# Altium schematic sheet Top.SchDoc
size C; Author: E. Sims; Organization: Let's Build Rockets Inc.; SheetNumber: 1; SheetTotal: 5
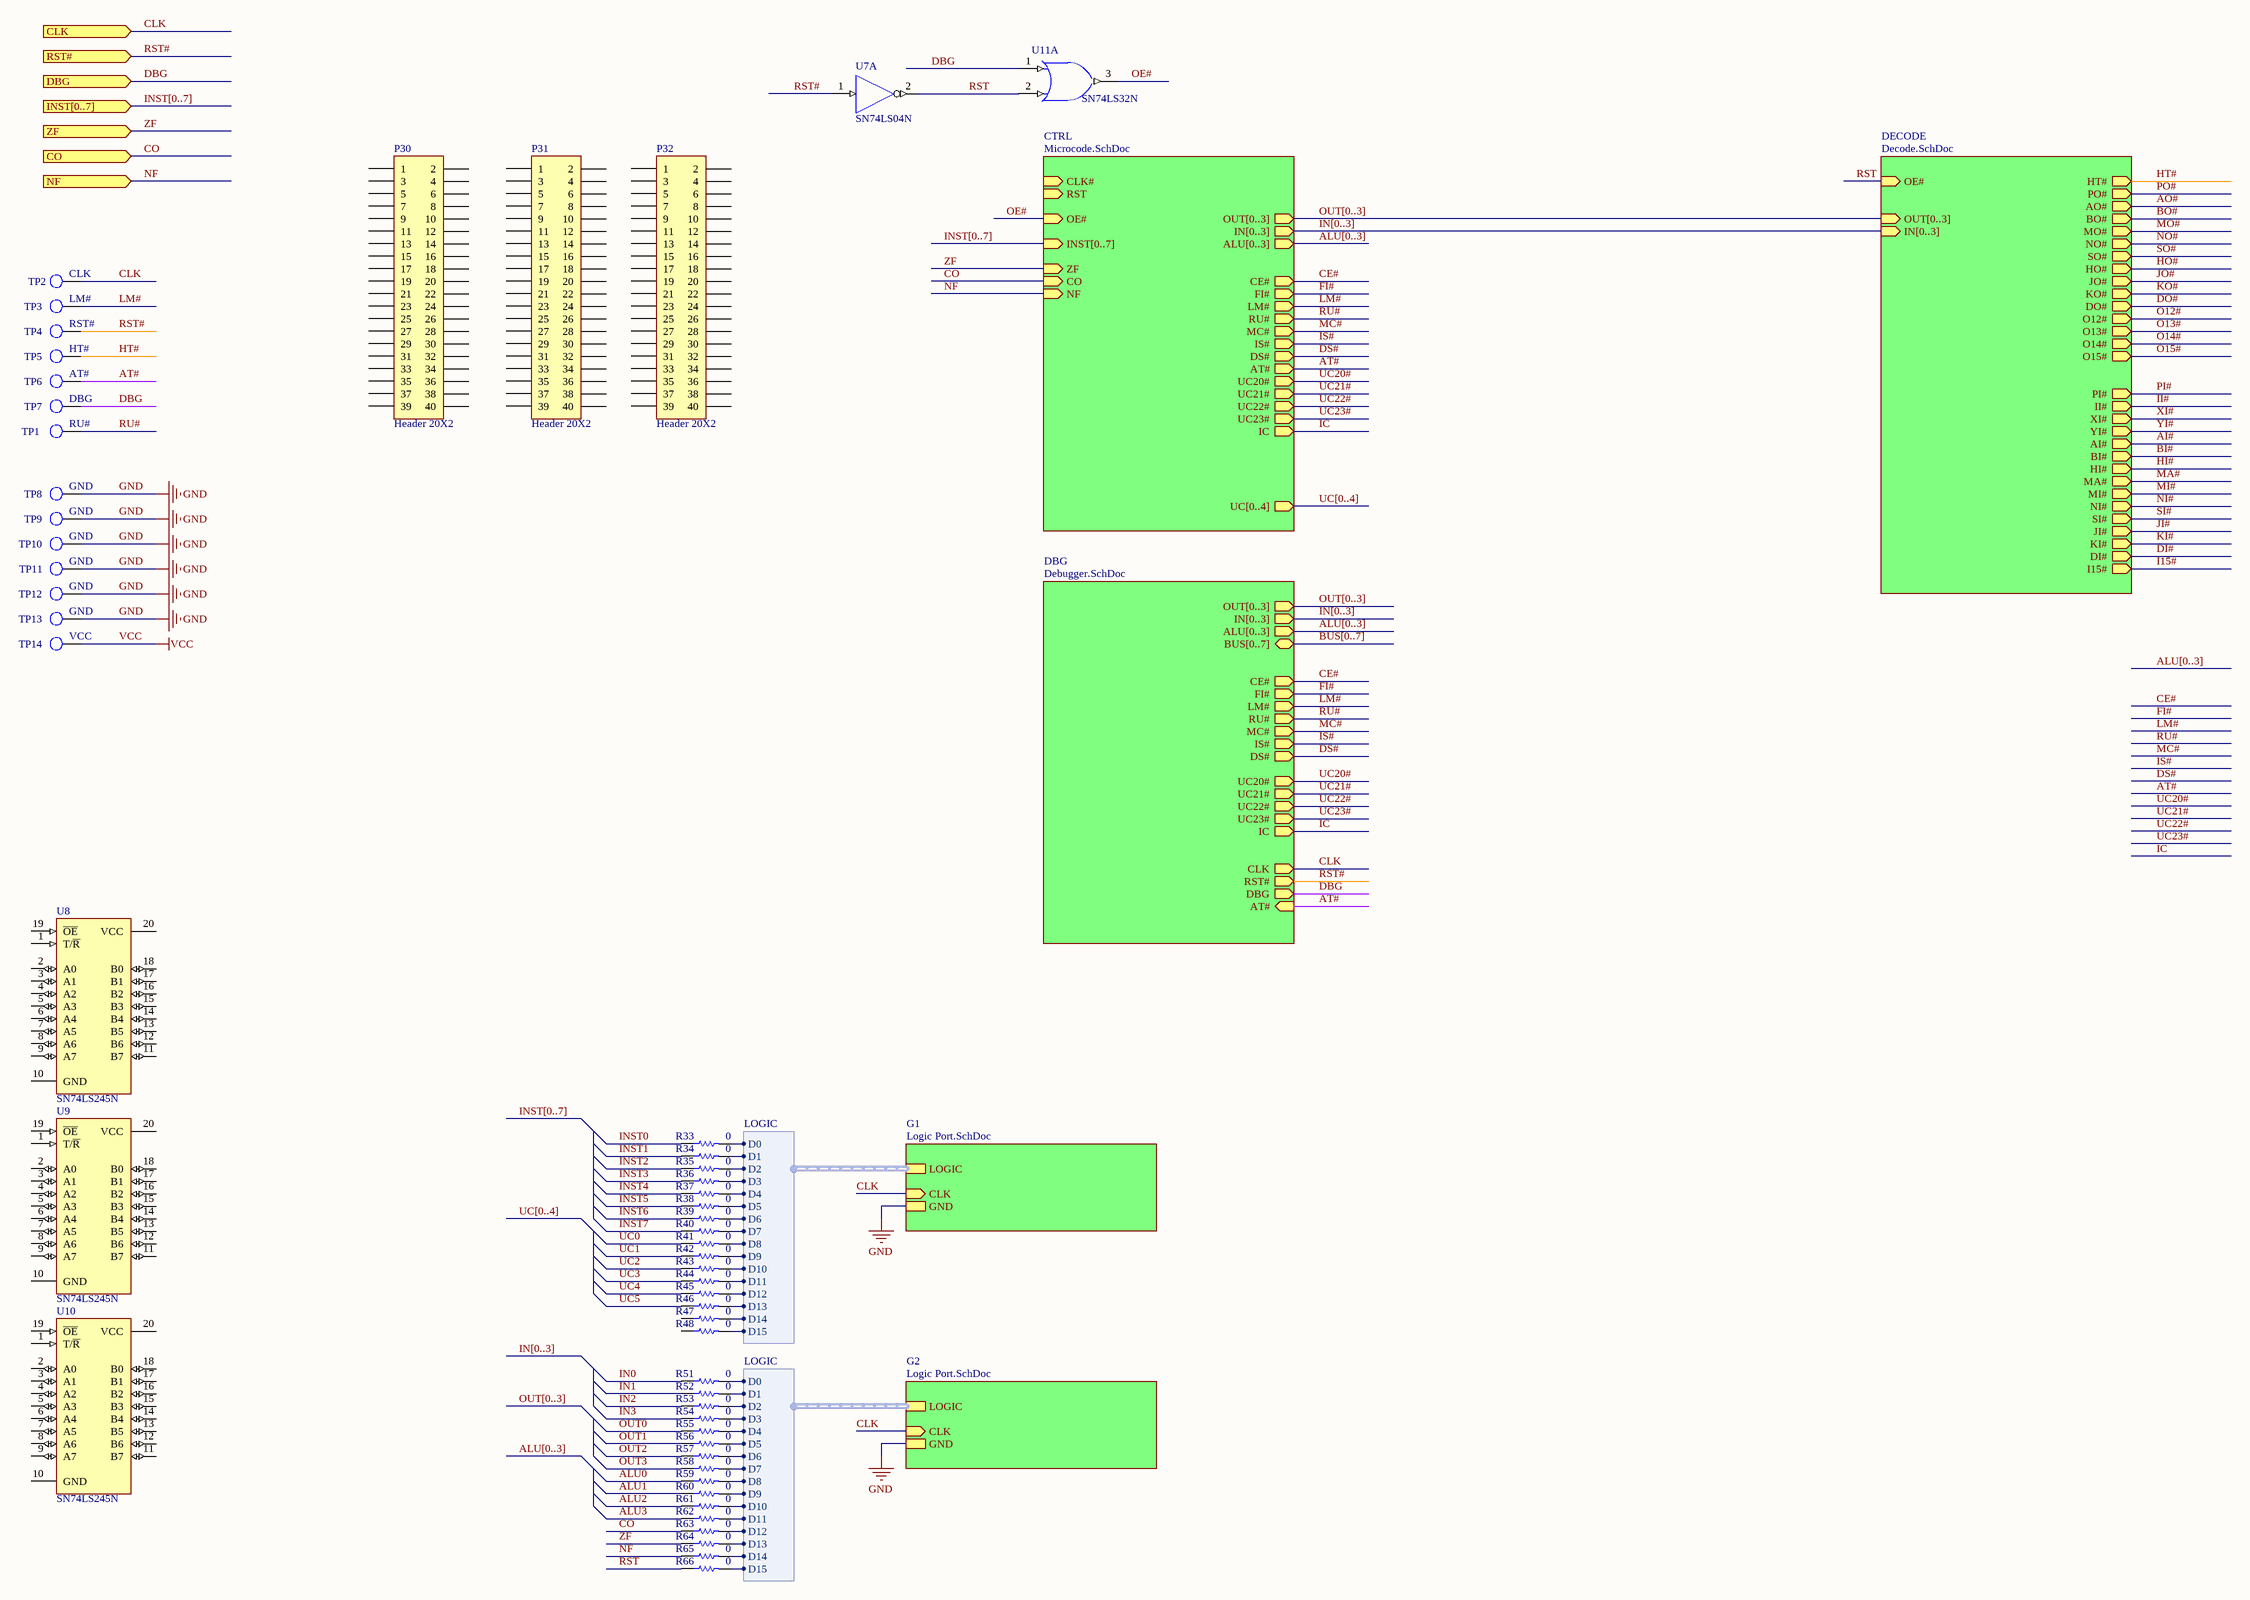
[diagram p0: Top.SchDoc]

## Parts
P30  Header 20X2  [HDR2X20]
P31  Header 20X2  [HDR2X20]
P32  Header 20X2  [HDR2X20]
R33  value 0  [AXIAL-0.3]  (hidden comment: Res1)
R34  value 0  [AXIAL-0.3]  (hidden comment: Res1)
R35  value 0  [AXIAL-0.3]  (hidden comment: Res1)
R36  value 0  [AXIAL-0.3]  (hidden comment: Res1)
R37  value 0  [AXIAL-0.3]  (hidden comment: Res1)
R38  value 0  [AXIAL-0.3]  (hidden comment: Res1)
R39  value 0  [AXIAL-0.3]  (hidden comment: Res1)
R40  value 0  [AXIAL-0.3]  (hidden comment: Res1)
R41  value 0  [AXIAL-0.3]  (hidden comment: Res1)
R42  value 0  [AXIAL-0.3]  (hidden comment: Res1)
R43  value 0  [AXIAL-0.3]  (hidden comment: Res1)
R44  value 0  [AXIAL-0.3]  (hidden comment: Res1)
R45  value 0  [AXIAL-0.3]  (hidden comment: Res1)
R46  value 0  [AXIAL-0.3]  (hidden comment: Res1)
R47  value 0  [AXIAL-0.3]  (hidden comment: Res1)
R48  value 0  [AXIAL-0.3]  (hidden comment: Res1)
R51  value 0  [AXIAL-0.3]  (hidden comment: Res1)
R52  value 0  [AXIAL-0.3]  (hidden comment: Res1)
R53  value 0  [AXIAL-0.3]  (hidden comment: Res1)
R54  value 0  [AXIAL-0.3]  (hidden comment: Res1)
R55  value 0  [AXIAL-0.3]  (hidden comment: Res1)
R56  value 0  [AXIAL-0.3]  (hidden comment: Res1)
R57  value 0  [AXIAL-0.3]  (hidden comment: Res1)
R58  value 0  [AXIAL-0.3]  (hidden comment: Res1)
R59  value 0  [AXIAL-0.3]  (hidden comment: Res1)
R60  value 0  [AXIAL-0.3]  (hidden comment: Res1)
R61  value 0  [AXIAL-0.3]  (hidden comment: Res1)
R62  value 0  [AXIAL-0.3]  (hidden comment: Res1)
R63  value 0  [AXIAL-0.3]  (hidden comment: Res1)
R64  value 0  [AXIAL-0.3]  (hidden comment: Res1)
R65  value 0  [AXIAL-0.3]  (hidden comment: Res1)
R66  value 0  [AXIAL-0.3]  (hidden comment: Res1)
TP1  RU#  [KSTN-5011_V]  (no BOM)
TP2  CLK  [KSTN-5011_V]  (no BOM)
TP3  LM#  [KSTN-5011_V]  (no BOM)
TP4  RST#  [KSTN-5011_V]  (no BOM)
TP5  HT#  [KSTN-5011_V]  (no BOM)
TP6  AT#  [KSTN-5011_V]  (no BOM)
TP7  DBG  [KSTN-5011_V]  (no BOM)
TP8  GND  [KSTN-5011_V]  (no BOM)
TP9  GND  [KSTN-5011_V]  (no BOM)
TP10  GND  [KSTN-5011_V]  (no BOM)
TP11  GND  [KSTN-5011_V]  (no BOM)
TP12  GND  [KSTN-5011_V]  (no BOM)
TP13  GND  [KSTN-5011_V]  (no BOM)
TP14  VCC  [KSTN-5011_V]  (no BOM)
U7  SN74LS04N  [N014]  (part A of 6)
U8  SN74LS245N  [N020]
U9  SN74LS245N  [N020]
U10  SN74LS245N  [N020]
U11  SN74LS32N  [N014]  (part A of 4)

## Sub-sheets
CTRL = Microcode.SchDoc: NF (in), RST (in), CLK# (in), ZF (in), INST[0..7] (in), CO (in), UC[0..4] (out), IN[0..3] (out), ALU[0..3] (out), OUT[0..3] (out), OE# (in), IS# (out), UC21# (out), RU# (out), AT# (out), MC# (out), CE# (out), IC (out), UC22# (out), DS# (out), FI# (out), UC23# (out), UC20# (out), LM# (out)
DBG = Debugger.SchDoc: IN[0..3] (out), ALU[0..3] (out), OUT[0..3] (out), IS# (out), UC21# (out), RU# (out), MC# (out), CE# (out), IC (out), UC22# (out), DS# (out), FI# (out), UC23# (out), UC20# (out), LM# (out), CLK (out), RST# (out), DBG (out), AT# (in), BUS[0..7] (bidir)
DECODE = Decode.SchDoc: IN[0..3] (in), OUT[0..3] (in), OE# (in), PO# (out), HT# (out), NO# (out), JO# (out), BO# (out), O14# (out), SO# (out), O15# (out), KO# (out), DO# (out), AO# (out), O12# (out), O13# (out), MO# (out), HO# (out), I15# (out), JI# (out), SI# (out), PI# (out), XI# (out), MI# (out), HI# (out), II# (out), DI# (out), NI# (out), BI# (out), MA# (out), YI# (out), KI# (out), AI# (out)
G1 = Logic Port.SchDoc: GND, CLK (in), LOGIC (harness LOGIC)
G2 = Logic Port.SchDoc: GND, CLK (in), LOGIC (harness LOGIC)

## Ports
CLK (in), CO (in), DBG (in), INST[0..7] (in), NF (in), RST# (in), ZF (in)

## Harnesses
LOGIC: D0, D1, D2, D3, D4, D5, D6, D7, D8, D9, D10, D11, D12, D13, D14, D15

## Nets
GND: TP8.1 TP9.1 TP10.1 TP11.1 TP12.1 TP13.1 U7.7(GND) U11.7(GND) ; sheet G1/GND, sheet G2/GND
VCC: TP14.1 U7.14(VCC) U11.14(VCC)
AI#: sheet DECODE/AI#
ALU0: R59.1
ALU1: R60.1
ALU2: R61.1
ALU3: R62.1
AO#: sheet DECODE/AO#
AT#: TP6.1 ; sheet CTRL/AT#, sheet DBG/AT#
BI#: sheet DECODE/BI#
BO#: sheet DECODE/BO#
CE#: sheet CTRL/CE#, sheet DBG/CE#
CLK: TP2.1 ; port CLK, sheet G1/CLK, sheet G2/CLK, sheet DBG/CLK
CO: R63.1 ; port CO, sheet CTRL/CO
DBG: TP7.1 U11.1(A) ; port DBG, sheet DBG/DBG
DI#: sheet DECODE/DI#
DO#: sheet DECODE/DO#
DS#: sheet CTRL/DS#, sheet DBG/DS#
FI#: sheet CTRL/FI#, sheet DBG/FI#
HI#: sheet DECODE/HI#
HO#: sheet DECODE/HO#
HT#: TP5.1 ; sheet DECODE/HT#
I15#: sheet DECODE/I15#
IC: sheet CTRL/IC, sheet DBG/IC
II#: sheet DECODE/II#
IN0: R51.1
IN1: R52.1
IN2: R53.1
IN3: R54.1
INST0: R33.1
INST1: R34.1
INST2: R35.1
INST3: R36.1
INST4: R37.1
INST5: R38.1
INST6: R39.1
INST7: R40.1
IS#: sheet CTRL/IS#, sheet DBG/IS#
JI#: sheet DECODE/JI#
JO#: sheet DECODE/JO#
KI#: sheet DECODE/KI#
KO#: sheet DECODE/KO#
LM#: TP3.1 ; sheet CTRL/LM#, sheet DBG/LM#
MA#: sheet DECODE/MA#
MC#: sheet CTRL/MC#, sheet DBG/MC#
MI#: sheet DECODE/MI#
MO#: sheet DECODE/MO#
NF: R65.1 ; port NF, sheet CTRL/NF
NI#: sheet DECODE/NI#
NO#: sheet DECODE/NO#
O12#: sheet DECODE/O12#
O13#: sheet DECODE/O13#
O14#: sheet DECODE/O14#
O15#: sheet DECODE/O15#
OE#: U11.3(Y) ; sheet CTRL/OE#
OUT0: R55.1
OUT1: R56.1
OUT2: R57.1
OUT3: R58.1
PI#: sheet DECODE/PI#
PO#: sheet DECODE/PO#
RST: R66.1 U7.2(Y) U11.2(B) ; sheet DECODE/OE#
RST#: TP4.1 U7.1(A) ; port RST#, sheet DBG/RST#
RU#: TP1.1 ; sheet CTRL/RU#, sheet DBG/RU#
SI#: sheet DECODE/SI#
SO#: sheet DECODE/SO#
UC0: R41.1
UC1: R42.1
UC2: R43.1
UC3: R44.1
UC4: R45.1
UC5: R46.1
UC20#: sheet CTRL/UC20#, sheet DBG/UC20#
UC21#: sheet CTRL/UC21#, sheet DBG/UC21#
UC22#: sheet CTRL/UC22#, sheet DBG/UC22#
UC23#: sheet CTRL/UC23#, sheet DBG/UC23#
XI#: sheet DECODE/XI#
YI#: sheet DECODE/YI#
ZF: R64.1 ; port ZF, sheet CTRL/ZF
NetR33_2: R33.2 ; sheet G1/LOGIC.D0
NetR34_2: R34.2 ; sheet G1/LOGIC.D1
NetR35_2: R35.2 ; sheet G1/LOGIC.D2
NetR36_2: R36.2 ; sheet G1/LOGIC.D3
NetR37_2: R37.2 ; sheet G1/LOGIC.D4
NetR38_2: R38.2 ; sheet G1/LOGIC.D5
NetR39_2: R39.2 ; sheet G1/LOGIC.D6
NetR40_2: R40.2 ; sheet G1/LOGIC.D7
NetR41_2: R41.2 ; sheet G1/LOGIC.D8
NetR42_2: R42.2 ; sheet G1/LOGIC.D9
NetR43_2: R43.2 ; sheet G1/LOGIC.D10
NetR44_2: R44.2 ; sheet G1/LOGIC.D11
NetR45_2: R45.2 ; sheet G1/LOGIC.D12
NetR46_2: R46.2 ; sheet G1/LOGIC.D13
NetR47_2: R47.2 ; sheet G1/LOGIC.D14
NetR48_2: R48.2 ; sheet G1/LOGIC.D15
NetR51_2: R51.2 ; sheet G2/LOGIC.D0
NetR52_2: R52.2 ; sheet G2/LOGIC.D1
NetR53_2: R53.2 ; sheet G2/LOGIC.D2
NetR54_2: R54.2 ; sheet G2/LOGIC.D3
NetR55_2: R55.2 ; sheet G2/LOGIC.D4
NetR56_2: R56.2 ; sheet G2/LOGIC.D5
NetR57_2: R57.2 ; sheet G2/LOGIC.D6
NetR58_2: R58.2 ; sheet G2/LOGIC.D7
NetR59_2: R59.2 ; sheet G2/LOGIC.D8
NetR60_2: R60.2 ; sheet G2/LOGIC.D9
NetR61_2: R61.2 ; sheet G2/LOGIC.D10
NetR62_2: R62.2 ; sheet G2/LOGIC.D11
NetR63_2: R63.2 ; sheet G2/LOGIC.D12
NetR64_2: R64.2 ; sheet G2/LOGIC.D13
NetR65_2: R65.2 ; sheet G2/LOGIC.D14
NetR66_2: R66.2 ; sheet G2/LOGIC.D15

Not connected (* = marked no-connect by the designer): P30 1 2 3 4 5 6 7 8 9 10 11 12 13 14 15 16 17 18 19 20 21 22 23 24 25 26 27 28 29 30 31 32 33 34 35 36 37 38 39 40; P31 1 2 3 4 5 6 7 8 9 10 11 12 13 14 15 16 17 18 19 20 21 22 23 24 25 26 27 28 29 30 31 32 33 34 35 36 37 38 39 40; P32 1 2 3 4 5 6 7 8 9 10 11 12 13 14 15 16 17 18 19 20 21 22 23 24 25 26 27 28 29 30 31 32 33 34 35 36 37 38 39 40; R47 1; R48 1; U8 1(T/~{R}) 2(A0) 3(A1) 4(A2) 5(A3) 6(A4) 7(A5) 8(A6) 9(A7) 10(GND) 11(B7) 12(B6) 13(B5) 14(B4) 15(B3) 16(B2) 17(B1) 18(B0) 19(~{OE}) 20(VCC); U9 1(T/~{R}) 2(A0) 3(A1) 4(A2) 5(A3) 6(A4) 7(A5) 8(A6) 9(A7) 10(GND) 11(B7) 12(B6) 13(B5) 14(B4) 15(B3) 16(B2) 17(B1) 18(B0) 19(~{OE}) 20(VCC); U10 1(T/~{R}) 2(A0) 3(A1) 4(A2) 5(A3) 6(A4) 7(A5) 8(A6) 9(A7) 10(GND) 11(B7) 12(B6) 13(B5) 14(B4) 15(B3) 16(B2) 17(B1) 18(B0) 19(~{OE}) 20(VCC)

## Buses and harness runs
bus ALU[0..3]
bus ALU[0..3] = sheet CTRL/ALU[0..3]
bus ALU[0..3] = sheet DBG/ALU[0..3]
bus BUS[0..7] = sheet DBG/BUS[0..7]
bus IN[0..3]
bus IN[0..3] = sheet CTRL/IN[0..3] = sheet DECODE/IN[0..3]
bus IN[0..3] = sheet DBG/IN[0..3]
bus INST[0..7]
bus INST[0..7] = port INST[0..7]
bus INST[0..7] = sheet CTRL/INST[0..7]
bus OUT[0..3]
bus OUT[0..3] = sheet CTRL/OUT[0..3] = sheet DECODE/OUT[0..3]
bus OUT[0..3] = sheet DBG/OUT[0..3]
bus UC[0..4]
bus UC[0..4] = sheet CTRL/UC[0..4]

## Notes on the sheet
- Let's Build Rocket's Inc. Modular Paylaod System Based on TMP-010 Rev
  For more information visit https://github.com/LetsBuildRockets/Modular-Payload-System
  This work is licensed under CC BY-NC 4.0. To view a copy of this license, visit https://creativecommons.org/licenses/by-nc/4.0
- Title
- Size:
- Date:
- Assembly Variant:
- B
- Number:
- Time:
- Revision:
- Sheet
- of
- Author:
- File:

## Library data of the parts
P30-P32 = Header 20X2: Header, 20-Pin, Dual row; System: Connector; LatestRevisionDate: 17-Jul-2002; LatestRevisionNote: Re-released for DXP Platform.; Publisher: Altium Limited
R33-R48 R51-R66 = Res1: Resistor; Published: 8-Jun-2000; LatestRevisionDate: 17-Jul-2002; LatestRevisionNote: Re-released for DXP Platform.; PackageReference: AXIAL-0.3; Publisher: Altium Limited; PackageDescription: Axial Device, Thru-Hole; 2 Leads; 0.3 in Pin Spacing
TP1-TP14 = TP
U7 = SN74LS04N: Hex Inverter; Published: 8-Jun-2000; LatestRevisionDate: 04-Mar-2005; LatestRevisionNote: Stylized 3D Model Added.; DatasheetVersion: Mar-1988; PackageVersion: Oct-1995; PackageReference: N014; Publisher: Altium Limited; PackageDescription: DIP; 14 Leads; Row Spacing 7.62 mm; Pitch 2.54 mm; ComponentLink1Description: Manufacturer Link; ComponentLink1URL: http://www.ti.com/; ComponentLink2Description: Datasheet; ComponentLink2URL: http://www-s.ti.com/sc/ds/sn74ls04.pdf
U8-U10 = SN74LS245N: Octal Bus Transceiver with 3-State Outputs; Published: 8-Jun-2000; LatestRevisionDate: 04-Mar-2005; LatestRevisionNote: Stylized 3D Model Added.; DatasheetVersion: Mar-1988; PackageVersion: Oct-1995; PackageReference: N020; Publisher: Altium Limited; PackageDescription: DIP; 20 Leads; Row Spacing 7.62 mm; Pitch 2.54 mm; ComponentLink1Description: Manufacturer Link; ComponentLink1URL: http://www.ti.com/; ComponentLink2Description: Datasheet; ComponentLink2URL: http://www-s.ti.com/sc/ds/sn74ls245.pdf
U11 = SN74LS32N: Quadruple 2-Input Positive-OR Gate; Published: 8-Jun-2000; LatestRevisionDate: 04-Mar-2005; LatestRevisionNote: Stylized 3D Model Added.; DatasheetVersion: Mar-1988; PackageVersion: Oct-1995; PackageReference: N014; Publisher: Altium Limited; PackageDescription: DIP; 14 Leads; Row Spacing 7.62 mm; Pitch 2.54 mm; ComponentLink1Description: Manufacturer Link; ComponentLink1URL: http://www.ti.com/; ComponentLink2Description: Datasheet; ComponentLink2URL: http://www-s.ti.com/sc/ds/sn74ls32.pdf